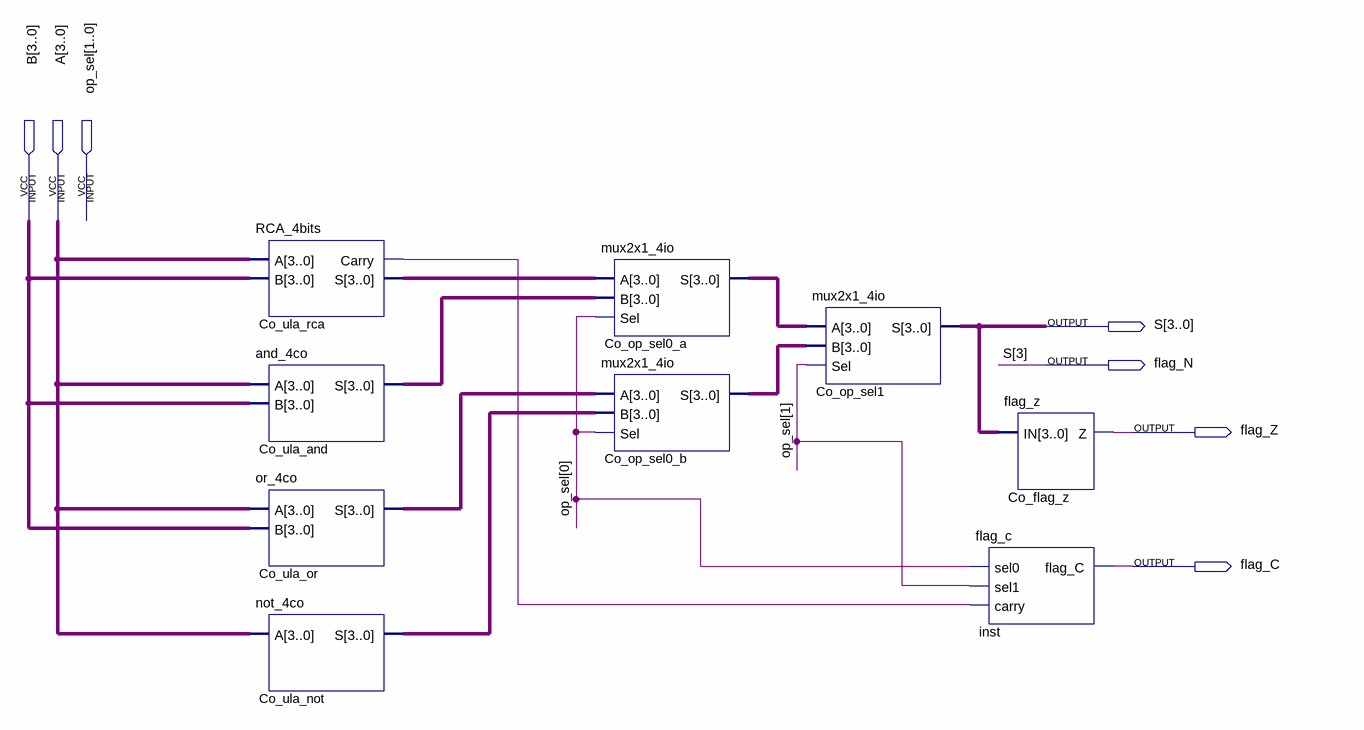
[diagram p0: schematic sheet]
// Quartus schematic ula.bdf as structural Verilog: 9 symbols, 7 pins
module ula (
  input  [3:0] B,
  input  [3:0] A,
  input  [1:0] op_sel,
  output [3:0] S,
  output flag_N,
  output flag_Z,
  output flag_C
);

  wire Co_ula_rca_carry;
  wire [3:0] Co_op_sel0_a_s, Co_op_sel0_b_s, Co_ula_and_s, Co_ula_not_s, Co_ula_or_s, Co_ula_rca_s;

  RCA_4bits Co_ula_rca (.A(A), .B(B), .Carry(Co_ula_rca_carry), .S(Co_ula_rca_s));
  and_4co Co_ula_and (.A(A), .B(B), .S(Co_ula_and_s));
  or_4co Co_ula_or (.A(A), .B(B), .S(Co_ula_or_s));
  not_4co Co_ula_not (.A(A), .S(Co_ula_not_s));
  mux2x1_4io Co_op_sel0_a (.A(Co_ula_rca_s), .B(Co_ula_and_s), .Sel(op_sel[0]), .S(Co_op_sel0_a_s));
  mux2x1_4io Co_op_sel0_b (.A(Co_ula_or_s), .B(Co_ula_not_s), .Sel(op_sel[0]), .S(Co_op_sel0_b_s));
  mux2x1_4io Co_op_sel1 (.A(Co_op_sel0_a_s), .B(Co_op_sel0_b_s), .Sel(op_sel[1]), .S({flag_N, S[2:0]}));
  flag_c inst (.sel0(op_sel[0]), .sel1(op_sel[1]), .carry(Co_ula_rca_carry), .flag_C(flag_C));
  flag_z Co_flag_z (.IN({flag_N, S[2:0]}), .Z(flag_Z));

  assign S[3] = flag_N;
endmodule
